# EAGLE design blink1mk3_005t3 (EAGLE 9.1.3)
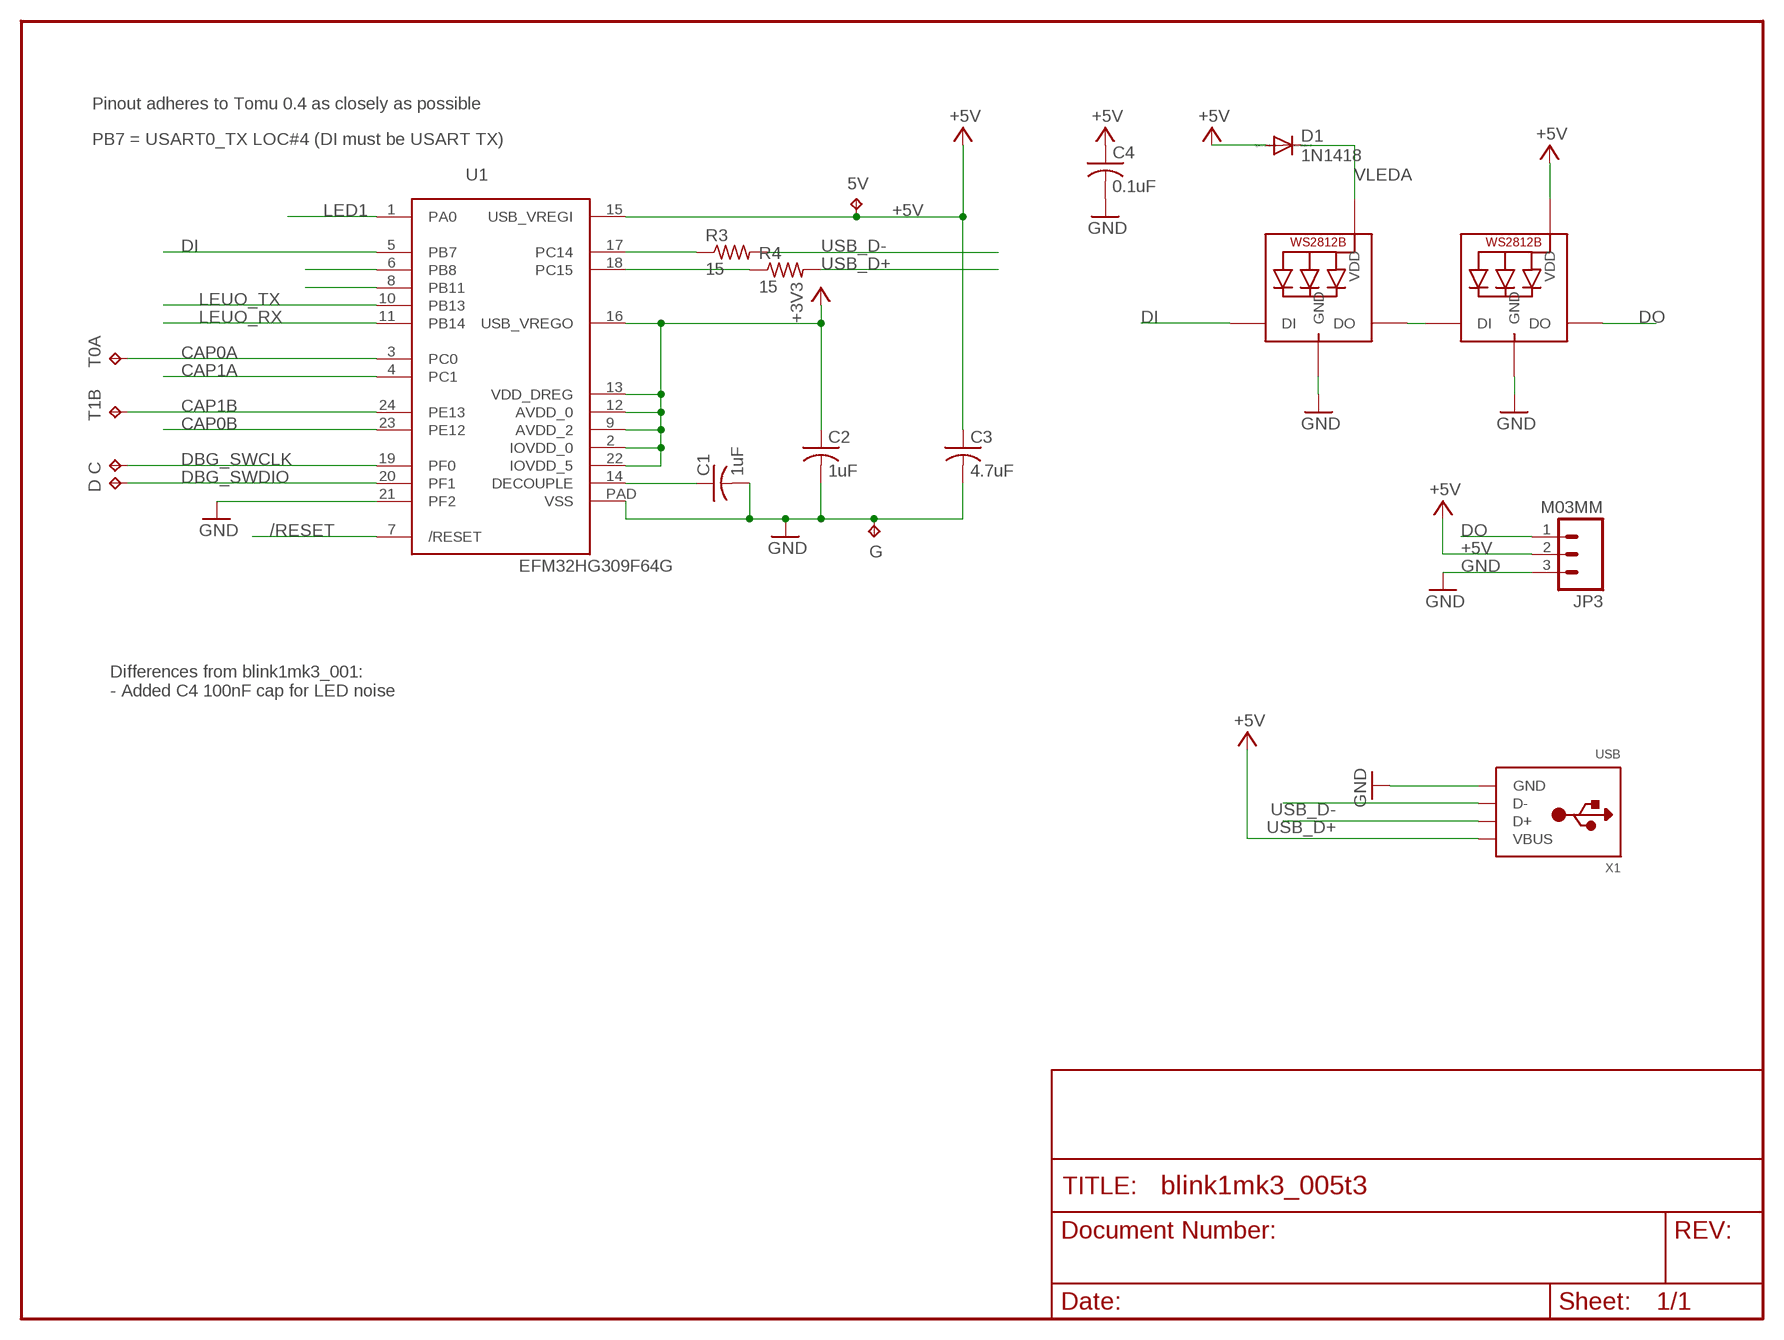
[diagram p0: schematic, sheet 1]

## Parts
5V  TPTP10R  [TP10R]
C  TPTP10R  [TP10R]
C1  1uF  C-USC0402  [C0402]
C2  1uF  C-USC0402  [C0402]
C3  4.7uF  C-USC0402  [C0402]
C4  0.1uF  C-USC0402  [C0402]
D  TPTP10R  [TP10R]
D1  1N1418  DIODE-SOD523  [SOD523]
G  TPTP10R  [TP10R]
JP3  M03MM  [1X03-1.5MM]
LED1  SK6812MINI  WS2812B3535  [LED3535]
LED2  SK6812MINI  WS2812B3535  [LED3535]
R3  15  R-US_R0402  [R0402]
R4  15  R-US_R0402  [R0402]
T0A  TPTP10R  [TP10R]
T1B  TPTP10R  [TP10R]
U1  EFM32HG309F64G  [QFN24PAD]
X1  USB  [MOLEX-48037-1000]

## Nets
+3V3: C2.1 U1.2(IOVDD_0) U1.9(AVDD_2) U1.12(AVDD_0) U1.13(VDD_DREG) U1.16(USB_VREGO) U1.22(IOVDD_5)
+5V: 5V.TP C3.1 C4.1 D1.A JP3.2 LED2.2(VDD) U1.15(USB_VREGI) X1.1(VBUS)
/RESET: U1.7(/RESET)
CAP0A: T0A.TP U1.3(PC0)
CAP0B: U1.23(PE12)
CAP1A: U1.4(PC1)
CAP1B: T1B.TP U1.24(PE13)
DBG_SWCLK: C.TP U1.19(PF0)
DBG_SWDIO: D.TP U1.20(PF1)
DECOUPLE: C1.1 U1.14(DECOUPLE)
DI: LED1.1(DI) U1.5(PB7)
DO: JP3.1 LED2.3(DO)
GND: C1.2 C2.2 C3.2 C4.2 G.TP JP3.3 LED1.4(GND) LED2.4(GND) U1.21(PF2) U1.PAD(VSS) X1.4(GND)
LED1: U1.1(PA0)
LEUO_RX: U1.11(PB14)
LEUO_TX: U1.10(PB13)
N$1: U1.8(PB11)
N$2: LED1.3(DO) LED2.1(DI)
N$3: U1.6(PB8)
RUSB_D+: R4.1 U1.18(PC15)
RUSB_D-: R3.1 U1.17(PC14)
USB_D+: R4.2 X1.3(D+)
USB_D-: R3.2 X1.2(D-)
VLEDA: D1.C LED1.2(VDD)

## Notes on the sheet
- Pinout adheres to Tomu 0.4 as closely as possible
- PB7 = USART0_TX LOC#4 (DI must be USART TX)
- Differences from blink1mk3_001:
  - Added C4 100nF cap for LED noise

## Library data of the parts
5V C D G T0A T1B = testpad:TP: Test pad
C1-C4 = adafruit:C-US: CAPACITOR, American symbol
D1 = diode:DIODE-: DIODE
JP3 = todstuff:M03
LED1 LED2 = adafruit:WS2812B
R3 R4 = adafruit:R-US_: RESISTOR, American symbol
U1 = todstuff:EFM32HG309F64G
X1 = todstuff:USB

## Board
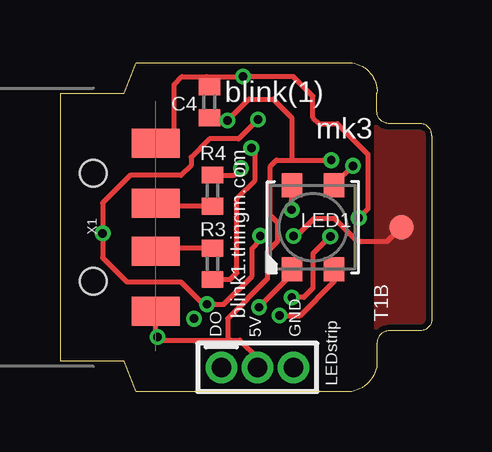
[diagram p1: board, top side]
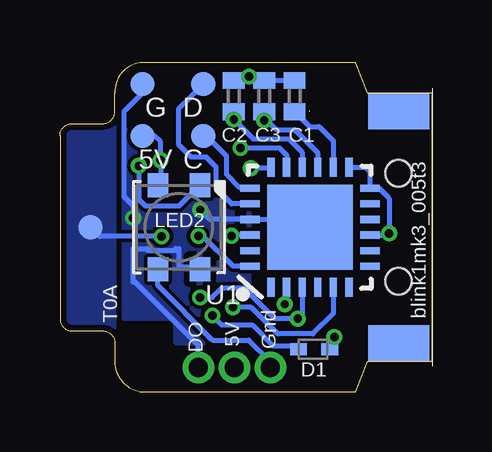
[diagram p2: board, bottom side, seen from below]

Size 15.49 x 13.72 mm. Coordinates in mm from the lower left corner, seen from the top.
Outline: 0,12.45 2.67,12.45 3.17,13.72 12.06,13.72 arc-90 13.21,12.45 13.21,11.69 arc90 13.72,11.18 14.99,11.18 arc-90 15.49,10.67 15.49,3.05 arc-90 14.99,2.55 13.72,2.55 arc90 13.21,2.04 13.21,1.15 arc-90 11.81,0.01 3.17,0.01 2.67,1.28 0,1.28 0,12.45
Copper layers (1*16): Top 0.035mm / dielectric 1.5mm / Bottom 0.035mm
Design rules "SeeedStudio_2layer_DRU_no_angle_20140221": minimum track width 6mil, minimum drill 12mil, track to track 6mil, track to pad 6mil, pad to pad 6mil, via to via 6mil, smd to smd 0mil, copper to edge 10mil, drill to drill 10mil, minimum pad ring 10mil, minimum via ring 6mil, stop-mask expansion 2mil, vias tented up to drill 100mil, thermal gap 10mil

### Footprints (pad centres in the part's own frame; a part is rotated, then mirrored left to right if it is on the bottom)
TP10R = smd 1 x 1: TP 0,0
C0402 = smd 0.7 x 0.9: 1 -0.65,0; 2 0.65,0
SOD523 = smd 0.7 x 0.5: A 0.7,0; C -0.6,0
1X03-1.5MM = drill 0.8 pad 1.27: 1 0,0; 2 1.5,0; 3 3,0
LED3535 = smd 1 x 0.85: 1 -1.75,0.875; 2 -1.75,-0.875; 3 1.75,-0.875; 4 1.75,0.875
R0402 = smd 0.7 x 0.9: 1 -0.65,0; 2 0.65,0
QFN24PAD = smd 0.8 x 0.3: 1 -2.5,1.625; 2 -2.5,0.975; 3 -2.5,0.325; 4 -2.5,-0.325; 5 -2.5,-0.975; 6 -2.5,-1.625; 13 2.5,-1.625; 14 2.5,-0.975; 15 2.5,-0.325; 16 2.5,0.325; 17 2.5,0.975; 18 2.5,1.625 | smd 0.3 x 0.8: 7 -1.625,-2.5; 8 -0.975,-2.5; 9 -0.325,-2.5; 10 0.325,-2.5; 11 0.975,-2.5; 12 1.625,-2.5; 19 1.625,2.5; 20 0.975,2.5; 21 0.325,2.5; 22 -0.325,2.5; 23 -0.975,2.5; 24 -1.625,2.5 | smd 3.55 x 3.55: PAD 0,0
MOLEX-48037-1000 = smd 2 x 1.2: 1 2.6,-3.5; 2 2.6,-1; 3 2.6,1; 4 2.6,3.5 | smd 2.54 x 1.524 bottom: P$1 0,4.85; P$2 0,-4.85 | hole 1.1: 0,2.25; 0,-2.25

### Placement (x,y rotation side)
5V  12.06,10.67 0 bottom
C  9.53,10.67 0 bottom
C1  5.71,12.33 90 bottom
C2  8.25,12.33 90 bottom
C3  6.99,12.33 90 bottom
C4  6.22,12.07 90 top
D  9.53,12.83 0 bottom
D1  4.95,1.78 0 bottom
G  12.06,12.83 180 bottom
JP3  6.73,1.02 0 top
LED1  10.54,6.86 90 top
LED2  10.54,6.86 270 bottom
R3  6.35,5.34 90 top
R4  6.35,8.39 270 top
T0A  14.22,6.86 0 bottom
T1B  14.22,6.86 0 top
U1  5.08,6.86 90 bottom
X1  1.39,6.86 0 top

### Tracks (layer width: path | path; a pad name or v marks a point on that pad's centre or on a via)
+3V3  (via drill 0.35)
  Top 0.203: v8.34,6.51 8.34,6.32 8,5.98 8,4.83 6.82,3.66 v6.13,3.66 5.97,3.66 5.05,4.58 2.79,4.58 1.78,5.59 v1.78,6.61 1.78,7.88 2.92,9.02 5.05,9.02 5.46,9.44 5.46,9.79 6.22,10.55 7.45,10.55 v8.25,11.36
  Bottom 0.203: C2.1 v8.25,11.36 | v8.25,11.36 | v8.25,11.36 7.45,10.55 5.97,10.55 5.41,9.98 U1.16 | U1.13 2.75,9.36 2.58,9.19 U1.12 2.2,8.49 1.78,8.07 v1.78,6.61 1.85,6.54 U1.9 | U1.2 6.06,3.73 v6.13,3.66 | U1.22 8.31,6.54 v8.34,6.51
+5V  (via drill 0.35)
  Top 0.203: JP3.2 8.23,1.38 8.25,1.4 7.49,2.17 7.11,2.17 6.99,2.17 | C4.1 6.33,11.31 v6.99,11.31 7.24,11.56 7.87,12.2 8.89,12.2 9.65,11.44 9.65,9.66 | 6.99,2.17 4.19,2.17 v4.06,2.29 3.99,2.37 X1.1 | 6.99,2.17 6.99,3.06 8.64,4.71 8.64,5.85 9.05,6.27 9.05,7.08 8.76,7.37 8.76,9.4 9.02,9.66 9.65,9.66 | 11.3,9.73 v11.3,9.66 9.65,9.66
  Bottom 0.203: v6.99,11.31 6.94,11.34 C3.1 v6.99,11.31 | v6.99,11.31 6.86,11.31 6.48,10.93 5.71,10.93 4.75,9.97 U1.15 | LED2.2 11.3,8.73 v11.3,9.66 11.3,10.42 11.56,10.67 5V.TP | v4.06,2.29 4.06,1.78 D1.A
CAP0A  (via drill 0.35)
  Top 0.203: v9.65,3.94 v9.66,3.94 10.16,3.94 10.54,4.32 10.54,5.76 v11.26,6.48
  Bottom 0.203: U1.3 5.41,3.24 v5.59,3.05 6.55,3.05 7.82,4.32 8.76,4.32 9.15,3.94 v9.65,3.94 | v11.26,6.48 13.84,6.48 T0A.TP
  pour Bottom (no thermals): 13.21,11.18 15.49,11.18 15.49,2.55 13.21,2.55
CAP1B  (via drill 0.35)
  Top 0.203: T1B.TP 13.64,6.28 12.39,6.28 11.43,7.25 10.6,7.25 9.85,6.5 v9.72,6.5
  Bottom 0.203: v9.72,6.5 9.54,6.5 8.28,5.24 U1.24
  pour Top (no thermals): 13.21,11.18 15.49,11.18 15.49,2.42 13.21,2.42
DBG_SWCLK
  Bottom 0.203: U1.19 7.98,8.49 8.55,9.07 8.55,9.83 9.27,10.55 9.53,10.55 C.TP
DBG_SWDIO
  Bottom 0.203: U1.20 8.34,7.84 8.99,8.49 8.99,9.37 9.14,9.53 9.4,9.79 10.03,9.79 10.54,10.29 10.54,11.82 10.03,12.33 D.TP
DECOUPLE
  Bottom 0.203: C1.1 5.09,11.06 4.7,11.06 4.11,10.46 U1.14
DI  (via drill 0.35)
  Top 0.203: v8.29,3.53 9.67,4.91 LED1.1
  Bottom 0.203: U1.5 4.11,3.27 4.95,2.42 6.42,2.42 7.53,3.53 v8.29,3.53
DO
  Bottom 0.203: JP3.1 6.73,1.28 7.62,2.17 9.14,2.17 11.42,4.44 LED2.3
GND  (via drill 0.35)
  Top 0.203: 6.1,13.14 5.08,13.14 4.75,12.81 4.75,10.47 4.64,10.36 X1.4 | 6.1,13.14 v7.62,13.14 9.72,13.14 10.35,12.52 10.54,12.33 10.54,11.44 10.79,11.18 11.56,11.18 12.83,9.91 12.83,7.63 v12.45,7.25 | C4.2 6.1,12.85 6.1,13.14 | v9.65,7.6 9.65,8.6 LED1.4
  Bottom 0.203: JP3.3 9.73,1.95 12.36,4.58 12.45,4.58 12.45,5.98 11.85,5.98 11.85,5.9 10.68,5.9 10.68,5.98 10.54,5.98 10.54,5.21 9.67,5.21 LED2.4 | v7.62,13.14 8.42,13.14 C2.2 C3.2 C1.2 | v9.65,7.6 9.25,7.19 U1.21 5.41,7.19 U1.PAD | v12.45,7.25 12.45,7.76 12.82,8.13 12.82,11.7 12.06,12.45 G.TP
  pour Bottom: 7.62,12.2 7.62,2.04 10.67,2.04 10.67,3.05 12.83,3.05 12.83,10.93 10.41,10.93 10.41,12.2
N$2  (via drill 0.35)
  Top 0.203: v12.21,9.42 11.42,8.63 LED1.3
  Bottom 0.203: v12.21,9.42 12.21,8.03 11.94,7.75 10.53,7.75 LED2.1
RUSB_D+  (via drill 0.35)
  Top 0.203: R4.1 7.26,9.04 v7.55,9.32
  Bottom 0.203: U1.18 6.75,9.32 v7.55,9.32
RUSB_D-  (via drill 0.35)
  Top 0.203: R3.1 7.1,4.69 7.37,4.96 7.37,8.06 8.13,8.83 8.13,10.04 8,10.17 v7.97,10.17
  Bottom 0.203: v7.97,10.17 6.35,10.17 6.06,9.87 U1.17
USB_D+
  Top 0.203: R4.2 4.71,7.74 4.57,7.88 4,7.88 X1.3
USB_D-
  Top 0.203: R3.2 4.68,5.99 4.57,6.1 4.23,6.1 X1.2
VLEDA  (via drill 0.35)
  Top 0.203: LED1.2 11.42,4.59 10.01,3.18 v9.14,3.18
  Bottom 0.203: D1.C 5.6,1.83 5.57,1.93 6.62,1.93 7.49,2.8 8.76,2.8 v9.14,3.18

### Text on the board
tPlace: blink(1) | mk3 | blink1.thingm.com | DO | 5V | GND | LEDstrip
bPlace: Gnd | blink1mk3_005t3 | 5V | DO